# EAGLE design transmitter (EAGLE 9.5.0)
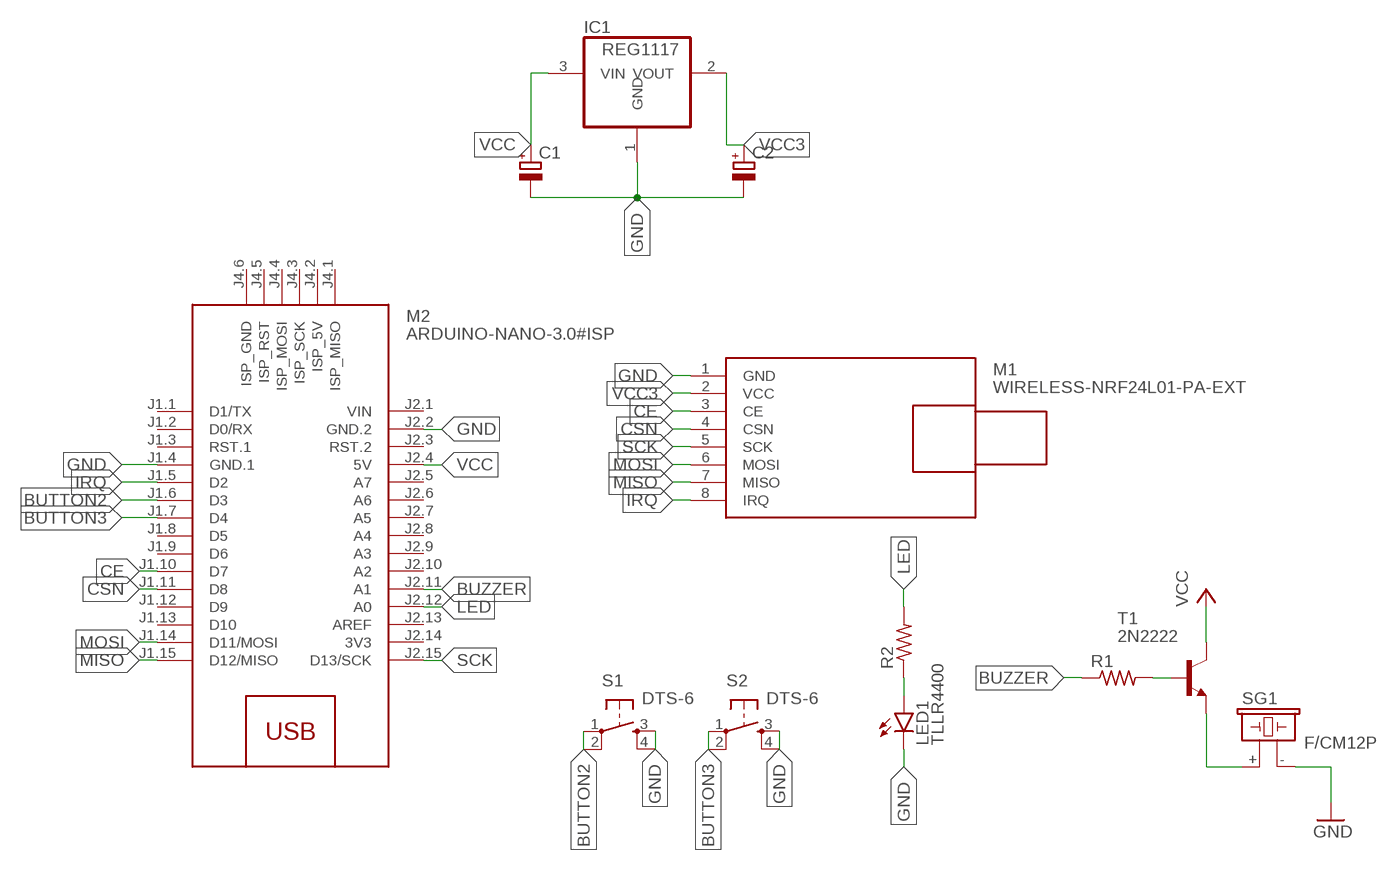
[diagram p0: schematic, sheet 1]

## Parts
C1  CPOL-EUE2,5-6E  [E2,5-6E]
C2  CPOL-EUE2,5-6E  [E2,5-6E]
IC1  REG1117  [SOT223]
LED1  TLLR4400  [LED3MM]
M1  WIRELESS-NRF24L01-PA-EXT  [WIRELESS-NRF24L01-PA-EXT]
M2  ARDUINO-NANO-3.0#ISP  [ARDUINO-NANO-3.0#ISP]
R1  R-US_R0805  [R0805]
R2  R-US_R0805  [R0805]
S1  DTS-6  [DTS-6]
S2  DTS-6  [DTS-6]
SG1  F/CM12P  [F/CM12P]
T1  2N2222  [TO92-EBC-OVAL]

## Nets
BUTTON2: M2.J1.6(D3) S1.1 S1.2
BUTTON3: M2.J1.7(D4) S2.1 S2.2
BUZZER: M2.J2.11(A1) R1.1
CE: M1.3(CE) M2.J1.10(D7)
CSN: M1.4(CSN) M2.J1.11(D8)
GND: C1.- C2.- IC1.1(GND) LED1.K(C) M1.1(GND) M2.J1.4(GND.1) M2.J2.2(GND.2) S1.3 S1.4 S2.3 S2.4 SG1.-
IRQ: M1.8(IRQ) M2.J1.5(D2)
LED: M2.J2.12(A0) R2.2
MISO: M1.7(MISO) M2.J1.15(D12/MISO)
MOSI: M1.6(MOSI) M2.J1.14(D11/MOSI)
N$1: SG1.+ T1.E
N$2: R1.2 T1.B
N$3: LED1.A R2.1
SCK: M1.5(SCK) M2.J2.15(D13/SCK)
VCC: C1.+ IC1.3(VIN) M2.J2.4(5V) T1.C
VCC3: C2.+ IC1.2(VOUT) M1.2(VCC)
Unconnected: M2.J1.1(D1/TX) M2.J1.2(D0/RX) M2.J1.3(RST.1) M2.J1.8(D5) M2.J1.9(D6) M2.J1.12(D9) M2.J1.13(D10) M2.J2.3(RST.2) M2.J2.5(A7) M2.J2.6(A6) M2.J2.7(A5) M2.J2.8(A4) M2.J2.9(A3) M2.J2.10(A2) M2.J2.13(AREF) M2.J4.1(ISP_MISO) M2.J4.2(ISP_5V) M2.J4.3(ISP_SCK) M2.J4.4(ISP_MOSI) M2.J4.5(ISP_RST) M2.J4.6(ISP_GND)

## Power pins joined to a net without a drawn wire
3V3: M2.J2.14(3V3)
VIN: M2.J2.1(VIN)

## Library data of the parts
C1 C2 = rcl:CPOL-EU: POLARIZED CAPACITOR, European symbol; SPICEPREFIX: C
IC1 = burr-brown:REG1117: 800mA and 1A Low Dropout (LDO) Positive Regulator 1.8V, 2.5V, 2.85V, 3.3V, 5V, and Adj; MPN: REG1117; OC_FARNELL: 1097566; OC_NEWARK: 14P6981
LED1 = led:TLLR4400: Low Current (2mA) LED 3 mm Tinted Diffused Package color RED Source: Data sheet <http://www.farnell.com/datasheets/391100.pdf>; MF: VISHAY SEMICONDUCTOR; OC_FARNELL: 1612437
M1 = Diy Library:WIRELESS-NRF24L01-PA-EXT: 2.4 GHz Wireless Module based on NRF24L01 chip with preamplifier and external antenna Click here to find device on ebay.com <http://www.ebay.com/sch/nrf24l01+pa+lna+sma>
M2 = Diy Library:ARDUINO-NANO-3.0#ISP: Arduino Nano 3.0 (and compatible devices) with ISP pads More details available here: https://www.arduino.cc/en/Main/ArduinoBoardNano Click here to find device on ebay.com <http://www.ebay.com/sch/arduino+nano>
R1 R2 = adafruit:R-US_: RESISTOR, American symbol
S1 S2 = switch-tact:DTS-6
SG1 = buzzer:F/CM12P: BUZZER Source: Buerklin; OC_FARNELL: unknown; OC_NEWARK: unknown
T1 = adafruit:2N2222: NPN TRANSISTOR Big oval pads

## Board
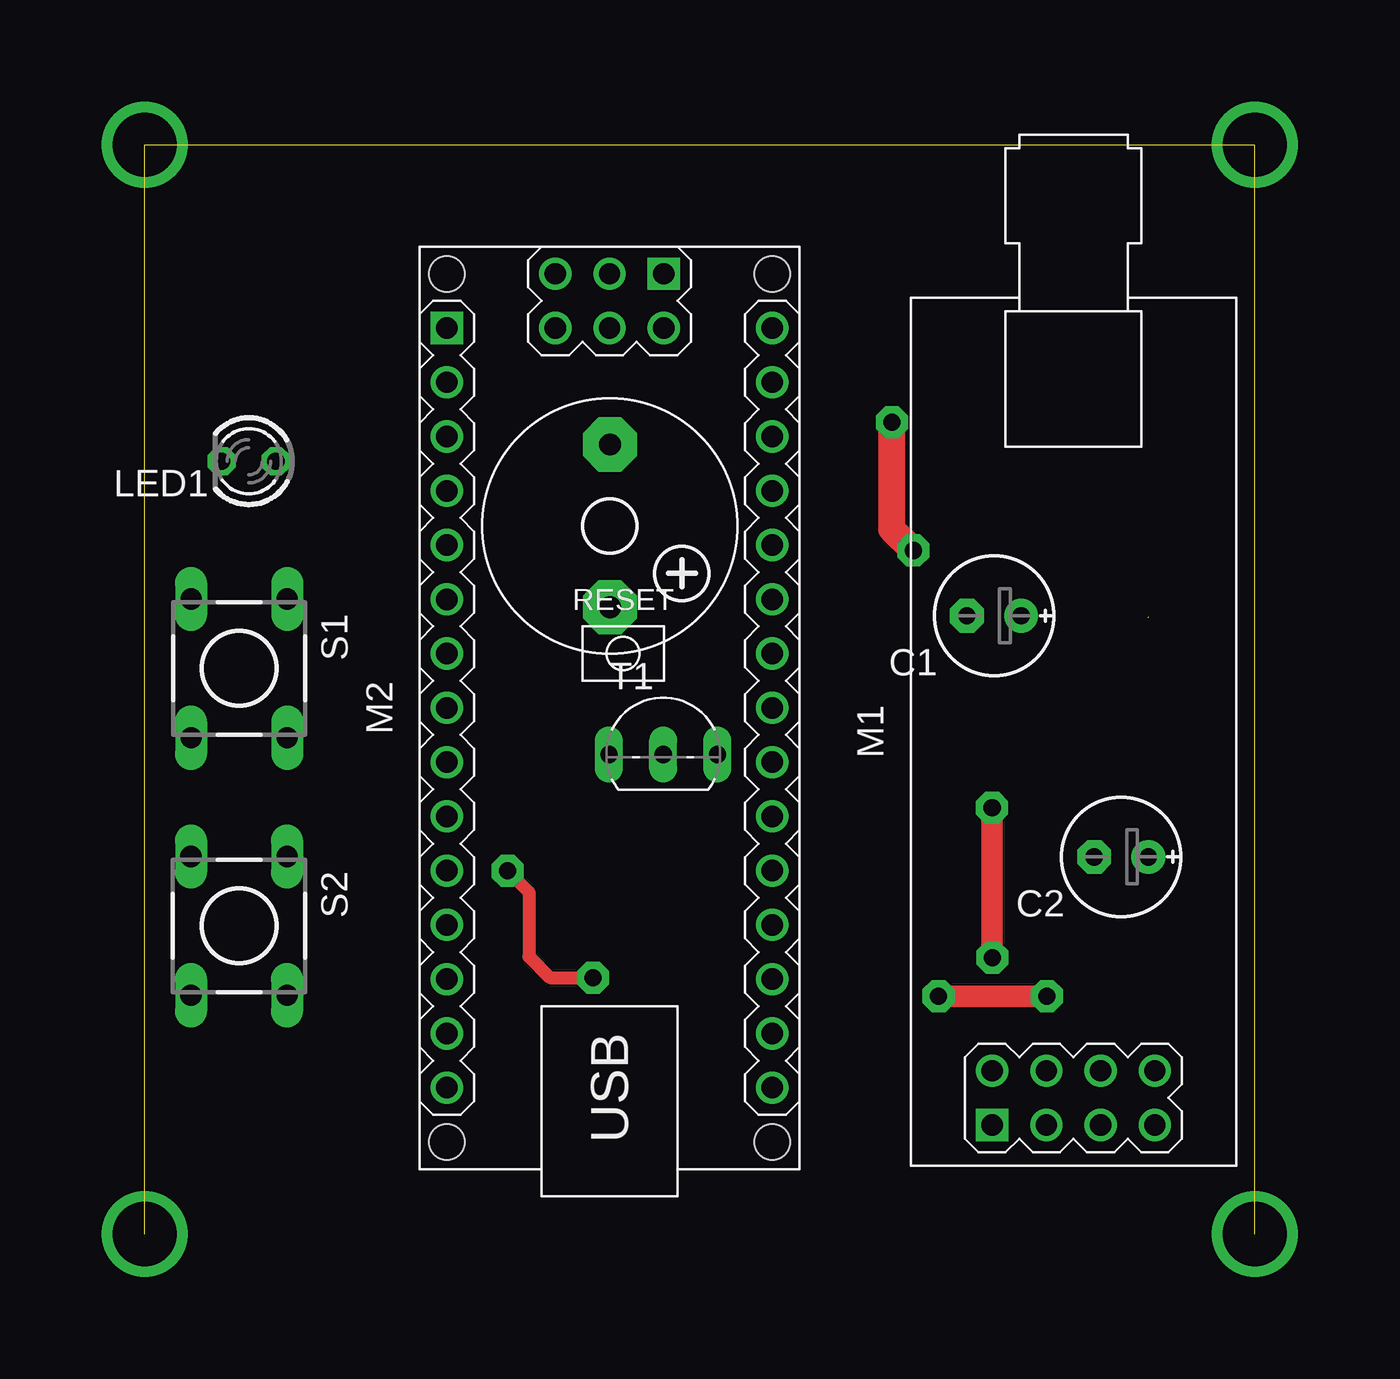
[diagram p1: board, top side]
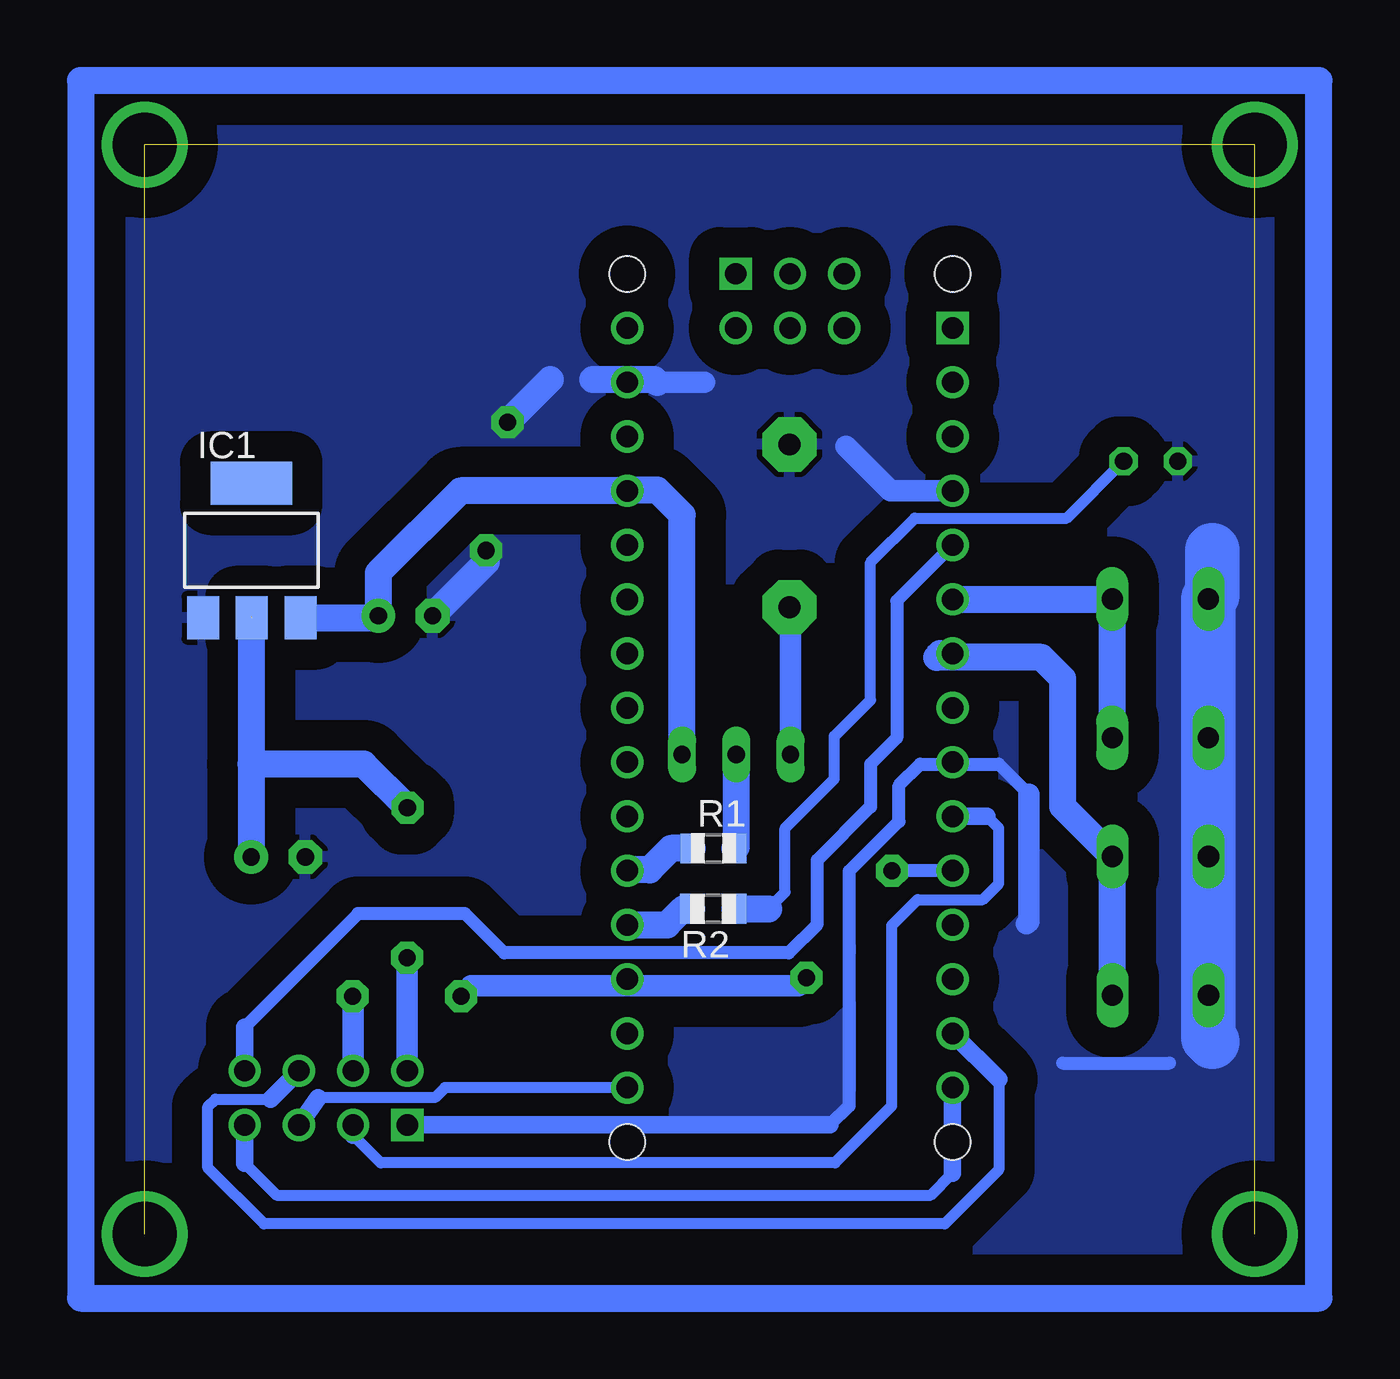
[diagram p2: board, bottom side, seen from below]

No outline drawn. Coordinates in mm, seen from the top.
Copper layers (1*16): Top 0.035mm / dielectric 1.5mm / Bottom 0.035mm
Design rules "default": minimum track width 6mil, minimum drill 0.35mm, track to track 6mil, track to pad 6mil, pad to pad 6mil, via to via 6mil, smd to smd 6mil, copper to edge 40mil, drill to drill 6mil, minimum pad ring 10mil, minimum via ring 8mil, stop-mask expansion 4mil, vias tented up to drill 0mil, thermal gap 10mil

### Footprints (pad centres in the part's own frame; a part is rotated, then mirrored left to right if it is on the bottom)
E2,5-6E = drill 0.813 pad 1.575: + -1.27,0 | drill 0.813 pad 1.575 octagon: - 1.27,0
SOT223 = smd 1.499 x 2.007: 1 -2.261,-3.15; 2 0.025,-3.15; 3 2.311,-3.15 | smd 3.81 x 2.007: 4 0,3.15
LED3MM = drill 0.813 octagon: A -1.27,0; K 1.27,0
WIRELESS-NRF24L01-PA-EXT = drill 1 square: 1 -18.415,3.81 | drill 1: 2 -15.875,3.81; 3 -18.415,1.27; 4 -15.875,1.27; 5 -18.415,-1.27; 6 -15.875,-1.27; 7 -18.415,-3.81; 8 -15.875,-3.81
ARDUINO-NANO-3.0#ISP = drill 1 square: J1.1 17.78,7.62; J4.1 20.32,-2.54 | drill 1: J1.2 15.24,7.62; J1.3 12.7,7.62; J1.4 10.16,7.62; J1.5 7.62,7.62; J1.6 5.08,7.62; J1.7 2.54,7.62; J1.8 0,7.62; J1.9 -2.54,7.62; J1.10 -5.08,7.62; J1.11 -7.62,7.62; J1.12 -10.16,7.62; J1.13 -12.7,7.62; J1.14 -15.24,7.62; J1.15 -17.78,7.62; J2.1 17.78,-7.62; J2.2 15.24,-7.62; J2.3 12.7,-7.62; J2.4 10.16,-7.62; J2.5 7.62,-7.62; J2.6 5.08,-7.62; J2.7 2.54,-7.62; J2.8 0,-7.62; J2.9 -2.54,-7.62; J2.10 -5.08,-7.62; J2.11 -7.62,-7.62; J2.12 -10.16,-7.62; J2.13 -12.7,-7.62; J2.14 -15.24,-7.62; J2.15 -17.78,-7.62; J4.2 17.78,-2.54; J4.3 20.32,0; J4.4 17.78,0; J4.5 20.32,2.54; J4.6 17.78,2.54 | hole 1.651: -20.32,7.62; -20.32,-7.62; 20.32,-7.62; 20.32,7.62
R0805 = smd 1.1 x 1.4: 1 -1,0; 2 1,0
DTS-6 = drill 1 long: 1 -3.25,2.25; 2 3.25,2.25; 3 -3.25,-2.25; 4 3.25,-2.25
F/CM12P = drill 1.016 pad 2.54 octagon: + 3.81,0; - -3.81,0
TO92-EBC-OVAL = drill 0.813 long: B 0,-1.27; C 2.54,-1.27; E -2.54,-1.27

### Placement (x,y rotation side)
C1  42.78,30.94 180 top
C2  48.74,19.66 180 top
IC1  50,34 0 bottom
LED1  7.88,38.18 180 top
M1  46.5,25.52 90 top
M2  24.78,26.63 90 top
R1  28.35,20.05 0 bottom
R2  28.37,17.23 180 bottom
S1  7.43,28.48 270 top
S2  7.43,16.43 270 top
SG1  24.8,35.16 270 top
T1  27.29,25.72 0 top

### Tracks (layer width: path | path; a pad name or v marks a point on that pad's centre or on a via)
BUTTON2
  Bottom 1.27: M2.J1.6 9.68,31.71 S1.1 S1.2
BUTTON3
  Bottom 1.27: S2.2 S2.1 12,22 12,28 13,29 17.91,29 17.74,29.17 M2.J1.7
BUZZER
  Bottom 1.016: 32.36,19.05 M2.J2.11
  Bottom 1.27: R1.1 30.35,20.05 31.35,19.05 32.36,19.05
CE
  Bottom 0.508: 45.23,6.62 43.94,5.33 22.67,5.33 20,8 20,16.45 18.8,17.65 15.75,17.65 15,18.4 15,21 15.55,21.55
  Bottom 0.813: 45.23,6.62 M1.3 | 15.55,21.55 M2.J1.10
CSN  (via drill 0.8 pad 1.5)
  Top 0.61: v20,19 21,18 21,15 22,14 v24,14
  Top 1.016: v45.26,13.14 v40.19,13.14 v40.18,13.14
  Bottom 0.61: M2.J1.11 19.99,19.01 v20,19
  Bottom 1.016: M1.4 45.23,13.11 v45.26,13.14 | v40.18,13.14 39.71,13.61 24.39,13.61 v24,14
GND  (via drill 0.8 pad 1.5)
  Top 1.27: v39,34 38,35 v38,40
  Bottom 0.61: 22.89,7.11 22,8 22,19 19.69,21.31 19.67,21.31 19.67,23 18.67,24 15,24 13.59,22.59 | 12,10 7,10
  Bottom 0.813: M1.1 22.89,7.11
  Bottom 1.016: 28.79,41.87 31,41.87 M2.J2.2 | M2.J1.4 20.07,36.79 22.16,38.88 | 13.59,22.59 13.59,16.62 13.69,16.52
  Bottom 1.27: S2.3 | 31,41.87 31.13,42 34,42 | C1.- 39,33.46 v39,34 | v38,40 36,42
  Bottom 2.54: 5,11 5.18,11.18 S1.3 5,31.91 5,34
  pour Bottom (isolate 1.422): 56,54 2,54 2,0 56,0
IRQ
  Bottom 0.61: 50.31,11.69 45,17 40,17 38.16,15.16 24.84,15.16 23.5,16.5 23.5,19.5 21,22 21,24 19.77,25.23 19.77,31.64 M2.J1.5
  Bottom 0.813: 50.31,11.69 M1.8
LED
  Bottom 1.27: M2.J2.12 30.53,16.47 29.77,17.23 R2.2
MISO
  Bottom 0.508: 50.31,5.31 48.83,3.83 18.18,3.83 17.16,4.84
  Bottom 0.813: M1.7 50.31,5.31 | 17.16,4.84 M2.J1.15
MOSI
  Bottom 0.508: 15,9.24 15,5 17.52,2.48 49.41,2.48 52.03,5.1 52.03,7.96 51.68,8.32 49.09,8.32
  Bottom 0.813: M2.J1.14 15,9.24 | 49.09,8.32 M1.6
N$1
  Bottom 1.016: T1.E 24.75,31.3 SG1.+
N$2
  Bottom 1.27: R1.2 27.29,20.11 T1.B
N$3
  Bottom 0.508: 25.77,17.23 25,18 25,21 22.7,23.3 22.7,25.3 21,27 21,33.44 18.92,35.52 11.81,35.52 LED1.A
  Bottom 1.27: R2.1 25.77,17.23
N$4
  Bottom 1.27: 0,56 58,56 58,-1 0,-1 0,56
N$5  (via drill 3 pad 1.3)  (3 unrouted)
  other vias: 3,2 55,2 55,53 3,53
SCK
  Bottom 0.508: M2.J2.15 40.93,8.85 41.4,8.38 46.86,8.38
  Bottom 0.813: 46.86,8.38 M1.5
VCC
  Bottom 1.27: T1.C 29.83,35.67 30.99,36.83 32.36,36.83 M2.J2.4 40.21,36.79 44.05,32.95 C1.+ 44.15,30.85 IC1.3
VCC3  (via drill 0.8 pad 1.5)  (1 unrouted)
  Top 1.016: v42.69,21.95 42.69,14.97 v42.71,14.95 v42.71,14.94
  Bottom 1.016: v42.69,21.95 | v42.71,14.94 42.71,9.66 M1.2
  Bottom 1.27: 50.01,30.89 50.01,24 | 50.01,24 C2.+ | v42.69,21.95 44.74,24 50.01,24

### Text on the board
tSilk: Buzzer | LED | Button 1 | NRF24L01+PA | ARDUINO | Nano | Button 2